# EAGLE board BatteryBoardV1 (EAGLE 7.7.0)
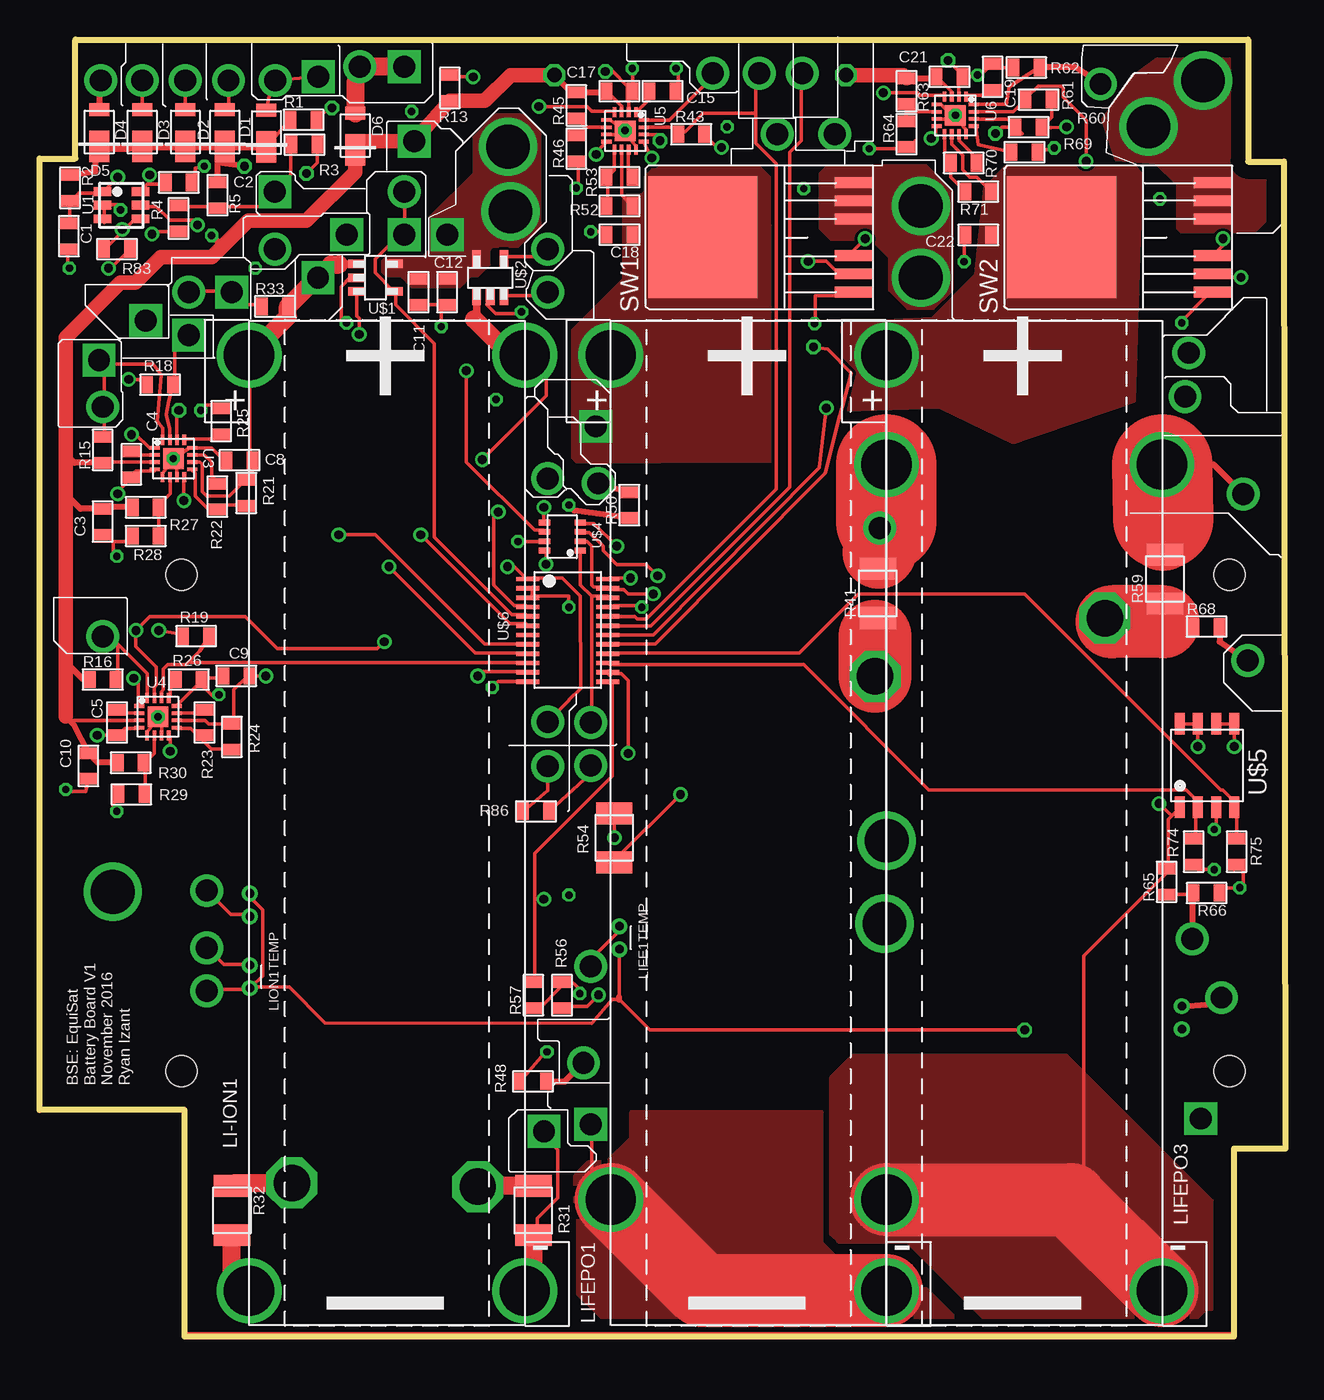
[diagram p6: board, top side]
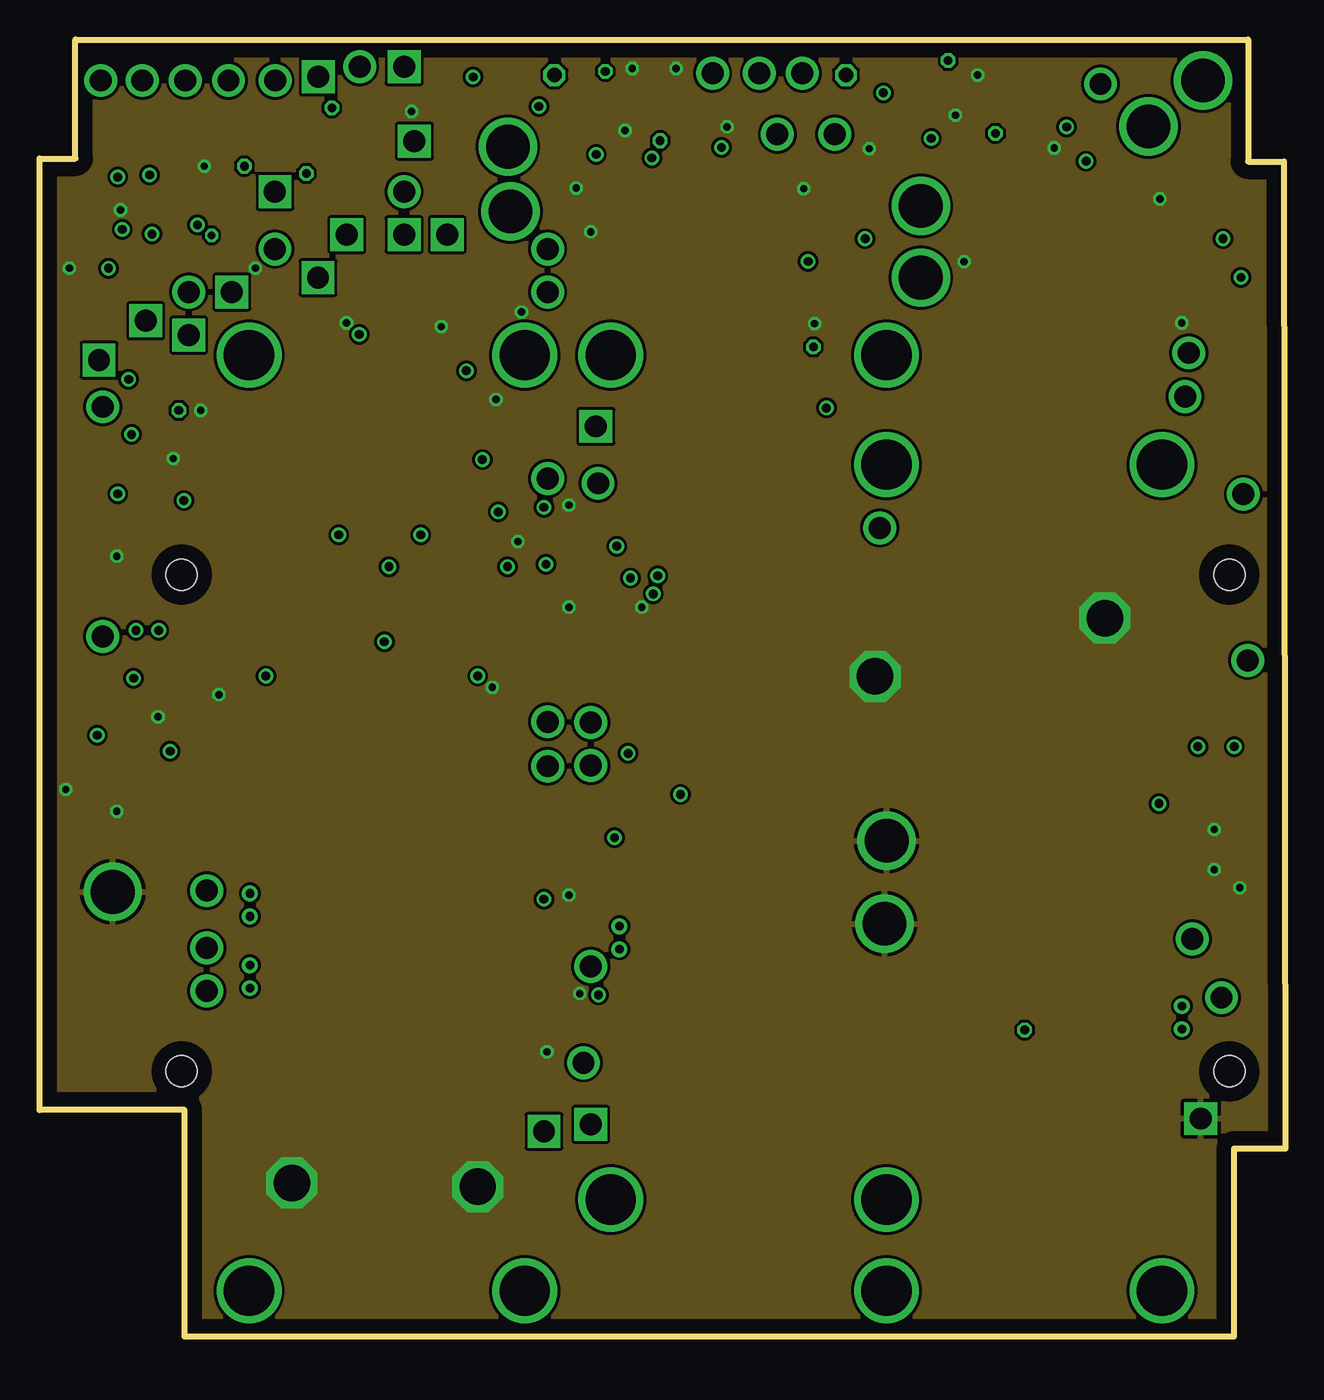
[diagram p7: board, inner layer Route2]
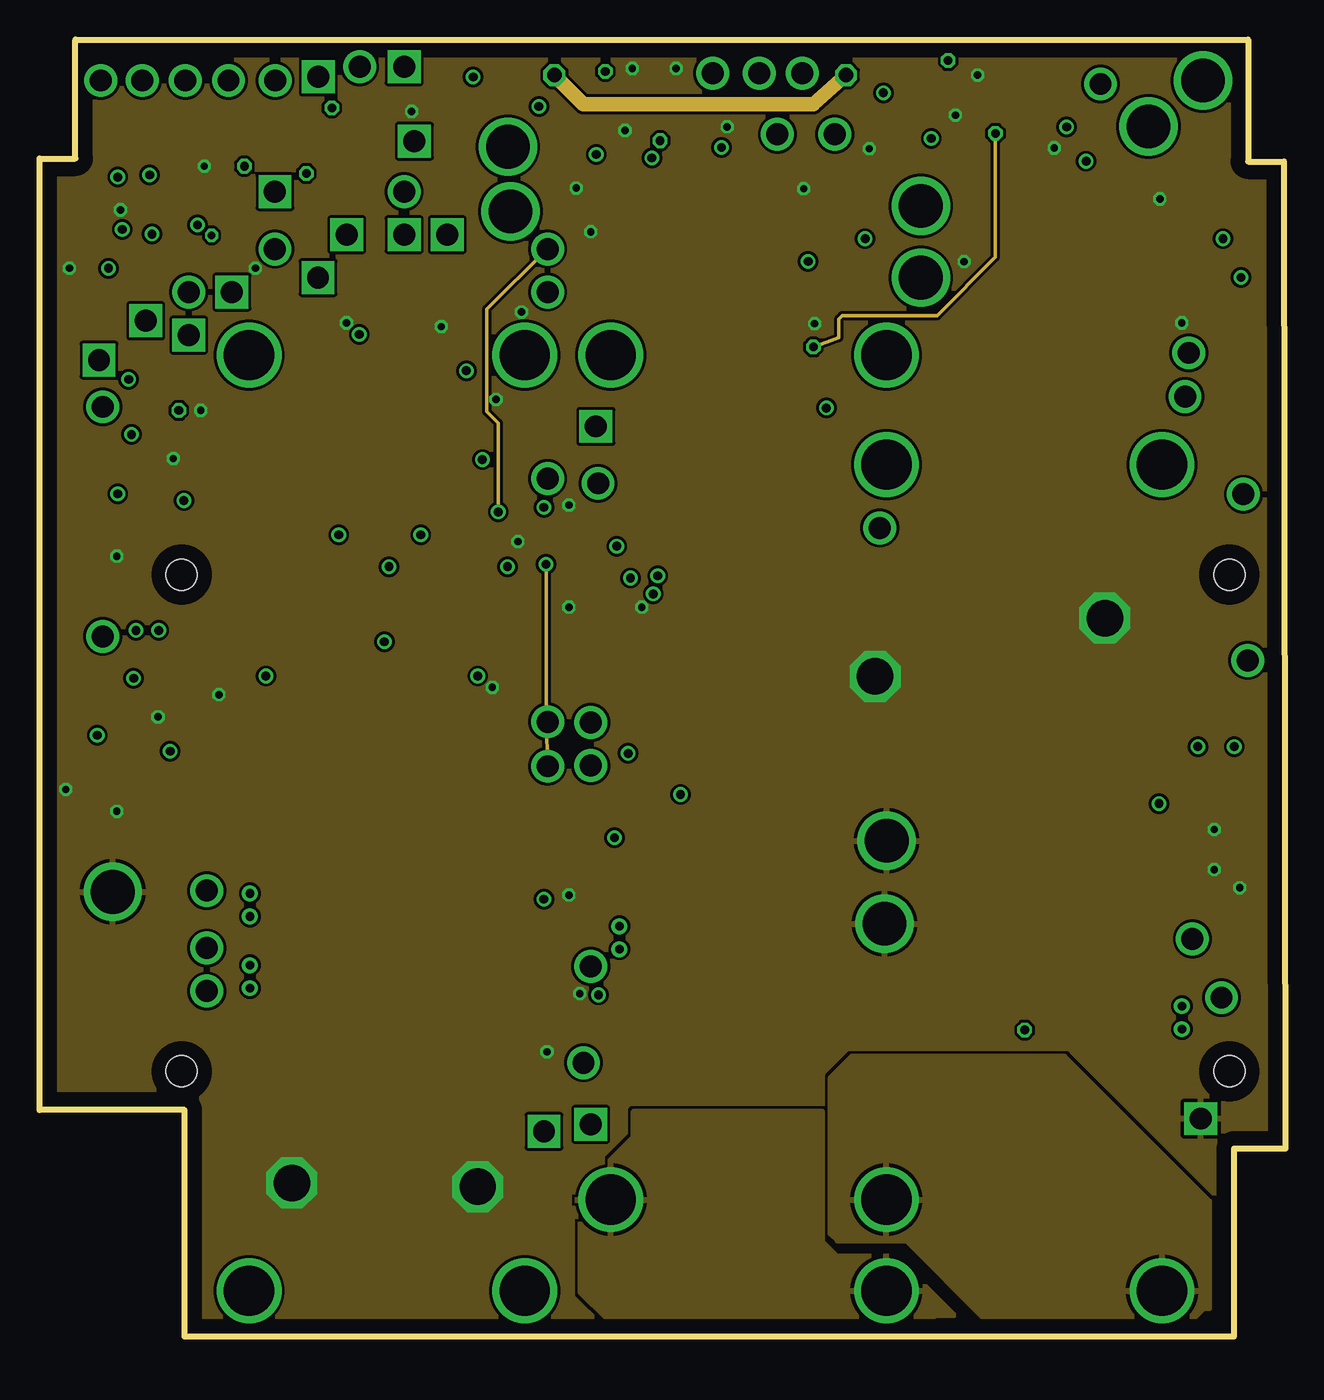
[diagram p8: board, inner layer Route3]
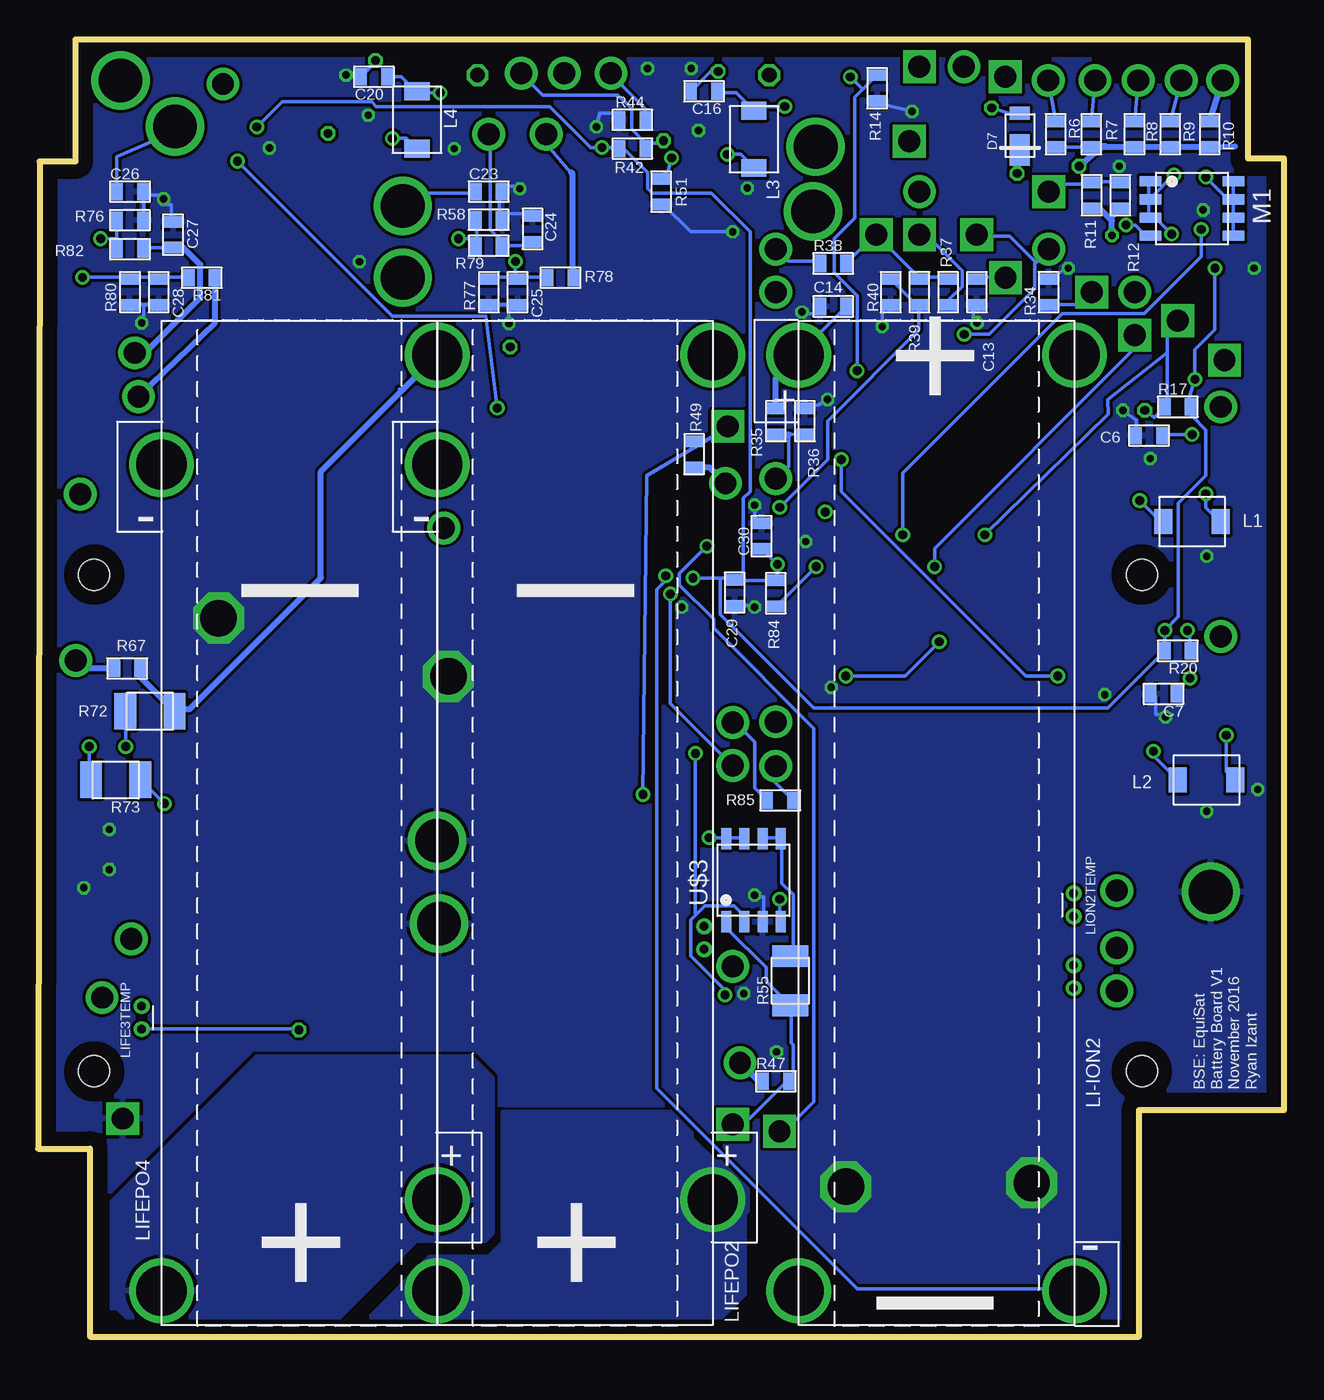
[diagram p9: board, bottom side, seen from below]

Size 86.79 x 90.4 mm. Coordinates in mm from the lower left corner, seen from the top.
Outline: 0,82.1 2.5,82.1 2.5,90.4 84.2,90.4 84.2,81.9 86.69,81.9 86.79,13.1 83.2,13.1 83.2,0 10.1,0 10.1,15.8 0,15.8 0,82.1
Copper layers (1*2*3*16): Top 0.035mm / dielectric 0.25mm / Route2 0.035mm / dielectric 0.25mm / Route3 0.035mm / dielectric 0.25mm / Bottom 0.035mm
Design rules "default *": minimum track width 10mil, minimum drill 24mil, track to track 8mil, track to pad 8mil, pad to pad 8mil, via to via 8mil, smd to smd 8mil, copper to edge 40mil, drill to drill 8mil, minimum pad ring 10mil, minimum via ring 8mil, stop-mask expansion 4mil, vias tented up to drill 0mil, thermal gap 10mil
Holes 2.15 mm at 9.9,18.5 9.9,53.1 82.9,18.5 82.9,53.1

## Footprints (pad centres in the part's own frame; a part is rotated, then mirrored left to right if it is on the bottom)
0805 = smd 0.8 x 1.2: 1 -0.9,0; 2 0.9,0
PWRDI-123 = smd 0.9 x 1.4: A 1.45,0 | smd 2.2 x 1.4: C -1.1,0
1812 = smd 1.25 x 1.75: P$1 -2,0; P$2 2,0
EQUISAT-BATTERY-VA = drill 3.5: MINUS 9.6,-32.6; PLUS -9.6,32.6
FLATPACK = drill 0.6: + -0.8,0; - 0.8,0
EQUISAT-BATTERY-VB = drill 3.5: MINUS 9.6,-24.98; PLUS -9.6,26.25
SO-8 = smd 0.7 x 1.5: P$1 -1.905,-2.9; P$2 -0.635,-2.9; P$3 0.635,-2.9; P$4 1.905,-2.9; P$5 1.905,2.9; P$6 0.635,2.9; P$7 -0.635,2.9; P$8 -1.905,2.9
1210 = smd 1.52 x 2.54: P$1 -1.71,0 | smd 1.51 x 2.54: P$2 1.71,0
TO-263-7-8 = smd 0.75 x 2.6: P$1 0,0.7; P$2 1.27,0.7; P$3 2.54,0.7; P$5 5.08,0.7; P$6 6.35,0.7; P$7 7.62,0.7 | smd 8.5 x 7.6: PAD 3.81,11.2
TSOT23-6 = smd 0.62 x 1.22: P$1 0,0; P$2 0.95,0; P$3 1.9,0; P$4 1.9,2.62; P$5 0.95,2.62; P$6 0,2.62
QFN-16-PAD = smd 0.7 x 0.25: P$1 -1.3,0.75; P$2 -1.3,0.25; P$3 -1.3,-0.25; P$4 -1.3,-0.75; P$9 1.3,-0.25; P$10 1.3,-0.75; P$11 1.3,0.25; P$12 1.3,0.75 | smd 0.25 x 0.7: P$5 -0.75,-1.3; P$6 -0.25,-1.3; P$7 0.25,-1.3; P$8 0.75,-1.3; P$13 0.75,1.3; P$14 0.25,1.3; P$15 -0.25,1.3; P$16 -0.75,1.3 | smd 1.45 x 1.45: P$17 0,0
TSOT23-5 = smd 0.6 x 1.2: P$1 -0.95,-1.306; P$2 0,-1.306; P$3 0.95,-1.306; P$4 0.95,1.306; P$5 -0.95,1.306
SOT-23-8 = smd 0.4 x 0.8: P$1 -1.016,-1.27; P$2 -0.366,-1.27; P$3 0.284,-1.27; P$4 0.934,-1.27; P$5 0.934,1.23; P$6 0.284,1.23; P$7 -0.366,1.23; P$8 -1.016,1.23
TSSOP-24 = smd 0.3 x 1.6: P$1 0,0; P$2 0.65,0; P$3 1.3,0; P$4 1.95,0; P$5 2.6,0; P$6 3.25,0; P$7 3.9,0; P$8 4.55,0; P$9 5.2,0; P$10 5.85,0; P$11 6.5,0; P$12 7.15,0; P$13 7.15,5.6; P$14 6.5,5.6; P$15 5.85,5.6; P$16 5.2,5.6; P$17 4.55,5.6; P$18 3.9,5.6; P$19 3.25,5.6; P$20 2.6,5.6; P$21 1.95,5.6; P$22 1.3,5.6; P$23 0.65,5.6; P$24 0,5.6
VIA-60MIL = drill 1.524: P$1 0,0
VIA-60MIL-SQ = drill 1.524 square: P$1 0,0
VIA-120MIL = drill 3.048: P$1 0,0

## Placement (x,y rotation side)
C1  0.1uF  [0805]  2.04,76.69 270 top
C2  0.1uF  [0805]  9.7,80.44 0 top
C3  10uF  [0805]  4.4,56.8 270 top
C4  22nF  [0805]  6.4,60.8 270 top
C5  22nF  [0805]  5.4,42.8 270 top
C6  2.2uF  [0805]  9.4,62.8 180 bottom
C7  2.2uF  [0805]  8.4,44.8 180 bottom
C8  22uF  [0805]  13.93,61.08 180 top
C9  22uF  [0805]  13.71,46.05 180 top
C10  10uF  [0805]  3.4,39.77 270 top
C11  4.7uF  [0805]  26.4,72.8 270 top
C12  4.7uF  [0805]  28.4,72.8 270 top
C13  1uF  [0805]  21.4,72.8 90 bottom
C14  1uF  [0805]  31.4,71.8 0 bottom
C15  2.2uF  [0805]  43.4,86.8 180 top
C16  22nF  [0805]  40.4,86.8 180 bottom
C17  10uF  [0805]  40.4,86.8 180 top
C18  22uF  [0805]  40.4,76.8 180 top
C19  2.2uF  [0805]  66.4,87.8 270 top
C20  22nF  [0805]  63.4,87.8 180 bottom
C21  10uF  [0805]  63.4,87.8 180 top
C22  22uF  [0805]  65.4,76.78 180 top
C23  10nF  [0805]  55.4,79.8 0 bottom
C24  10nF  [0805]  52.35,77.2 90 bottom
C25  150nF  [0805]  53.4,72.8 90 bottom
C26  10nF  [0805]  80.4,79.8 0 bottom
C27  10nF  [0805]  77.4,76.8 90 bottom
C28  150nF  [0805]  78.4,72.8 90 bottom
C29  0.1uF  [0805]  38.28,51.85 270 bottom
C30  0.1uF  [0805]  36.4,55.8 90 bottom
D1  DFLS130L  [PWRDI-123]  15.81,84.01 90 top
D2  DFLS130L  [PWRDI-123]  12.91,84.05 90 top
D3  DFLS130L  [PWRDI-123]  10.16,84.05 90 top
D4  DFLS130L  [PWRDI-123]  7.16,84.05 90 top
D5  DFLS130L  [PWRDI-123]  4.16,84.05 90 top
D6  DFLS130L  [PWRDI-123]  22,83.81 90 top
D7  DFLS130L  [PWRDI-123]  18.4,83.8 90 bottom
L1  120uH  [1812]  6.4,56.8 180 bottom
L2  120uH  [1812]  5.4,38.8 180 bottom
L3  120uH  [1812]  36.93,83.45 90 bottom
L4  120uH  [1812]  60.4,84.8 90 bottom
LI-ION1  ~4.1V  [EQUISAT-BATTERY-VA]  24.2,35.8 0 top
LI-ION2  ~4.1V  [EQUISAT-BATTERY-VA]  24.2,35.8 0 bottom
LIFE1TEMP  AD590FLATPACK  [FLATPACK]  40.4,27.8 90 top
LIFE3TEMP  AD590FLATPACK  [FLATPACK]  79.59,22.23 90 bottom
LIFEPO1  ~3.5V  [EQUISAT-BATTERY-VA]  49.4,35.8 0 top
LIFEPO2  ~3.5V  [EQUISAT-BATTERY-VB]  49.4,35.8 180 bottom
LIFEPO3  ~3.5V  [EQUISAT-BATTERY-VA]  68.6,35.8 0 top
LIFEPO4  ~3.5V  [EQUISAT-BATTERY-VB]  68.6,35.8 180 bottom
LION1TEMP  AD590FLATPACK  [FLATPACK]  14.65,25.09 90 top
LION2TEMP  AD590FLATPACK  [FLATPACK]  14.65,30.09 270 bottom
M1  BSO201SP  [SO-8]  6.41,78.62 270 bottom
R1  0R  [0805]  18.4,84.8 0 top
R2  0R  [0805]  2.12,80.05 270 top
R3  0R  [0805]  18.46,83.08 180 top
R4  0R  [0805]  9.68,77.93 90 top
R5  0R  [0805]  12.4,79.55 270 top
R6  0R  [0805]  15.91,83.8 270 bottom
R7  0R  [0805]  13.42,83.8 270 bottom
R8  0R  [0805]  10.42,83.8 270 bottom
R9  0R  [0805]  7.92,83.8 270 bottom
R10  0R  [0805]  5.18,83.8 270 bottom
R11  10R  [0805]  13.4,79.55 270 bottom
R12  0R  [0805]  11.4,79.55 270 bottom
R13  40K  [0805]  28.58,87.02 270 top
R14  10K  [0805]  28.34,87.01 90 bottom
R15  10K  [0805]  4.4,61.8 90 top
R16  10K  [0805]  4.4,45.8 0 top
R17  10K  [0805]  7.4,64.8 0 bottom
R18  10K  [0805]  8.4,66.34 180 top
R19  10K  [0805]  10.91,48.82 180 top
R20  10K  [0805]  7.4,47.8 180 bottom
R21  1M  [0805]  14.4,58.8 90 top
R22  1.43M  [0805]  12.39,58.55 270 top
R23  1.43M  [0805]  11.49,42.8 270 top
R24  1M  [0805]  13.4,41.8 90 top
R25  12.1K  [0805]  12.65,63.8 270 top
R26  12.1K  [0805]  10.4,45.8 180 top
R27  330K  [0805]  7.4,57.8 180 top
R28  43K  [0805]  7.4,55.8 0 top
R29  43K  [0805]  6.4,37.8 0 top
R30  330K  [0805]  6.36,40 180 top
R31  0.13R@1W  [1210]  34.4,8.8 270 top
R32  0.13R@1W  [1210]  13.4,8.8 270 top
R33  150K  [0805]  16.4,71.8 0 top
R34  100K  [0805]  16.4,72.8 270 bottom
R35  150K  [0805]  35.4,63.8 90 bottom
R36  100K  [0805]  33.38,63.8 270 bottom
R37  470K  [0805]  23.4,72.8 90 bottom
R38  470K  [0805]  31.4,74.8 0 bottom
R39  150K  [0805]  25.4,72.8 90 bottom
R40  100K  [0805]  27.4,72.8 90 bottom
R41  0.002R@1W  [1210]  58.4,51.8 90 top
R42  10K  [0805]  45.4,82.8 180 bottom
R43  10K  [0805]  45.4,83.8 0 top
R44  100K  [0805]  45.4,84.8 0 bottom
R45  330K  [0805]  37.4,85.8 90 top
R46  43K  [0805]  37.4,82.8 90 top
R47  95K  [0805]  35.4,17.8 0 bottom
R48  100K  [0805]  34.38,17.78 0 top
R49  287K  [0805]  41.09,61.5 270 bottom
R50  100K  [0805]  41.08,57.96 90 top
R51  12.1K  [0805]  43.4,79.8 270 bottom
R52  887K  [0805]  40.4,80.8 180 top
R53  1.74M  [0805]  40.4,78.8 0 top
R54  34.8R@1W  [1210]  40.04,34.76 270 top
R55  34.8R@1W  [1210]  34.4,24.8 90 bottom
R56  10K  [0805]  36.4,23.8 270 top
R57  10K  [0805]  34.4,23.8 90 top
R58  1K  [0805]  55.4,77.83 180 bottom
R59  0.002R@1W  [1210]  78.4,52.8 90 top
R60  10K  [0805]  68.91,84.29 0 top
R61  10K  [0805]  69.61,86.22 0 top
R62  100K  [0805]  68.75,88.45 0 top
R63  330K  [0805]  60.4,86.8 90 top
R64  43K  [0805]  60.4,83.8 90 top
R65  95K  [0805]  78.52,31.7 90 top
R66  100K  [0805]  81.31,30.92 180 top
R67  287K  [0805]  80.59,46.58 180 bottom
R68  100K  [0805]  81.31,49.48 0 top
R69  12.1K  [0805]  68.62,82.55 0 top
R70  887K  [0805]  64.38,81.8 180 top
R71  1.74M  [0805]  65.4,79.8 0 top
R72  34.8R@1W  [1210]  79.02,43.59 0 bottom
R73  34.8R@1W  [1210]  81.4,38.8 180 bottom
R74  10K  [0805]  80.4,33.8 90 top
R75  10K  [0805]  83.4,33.8 90 top
R76  1K  [0805]  80.4,77.8 180 bottom
R77  1K  [0805]  55.4,72.8 90 bottom
R78  4.7K  [0805]  50.4,73.8 180 bottom
R79  4.7K  [0805]  55.4,76.02 180 bottom
R80  1K  [0805]  80.4,72.8 90 bottom
R81  4.7K  [0805]  75.4,73.8 180 bottom
R82  4.7K  [0805]  80.4,75.8 180 bottom
R83  470K  [0805]  5.4,75.8 0 top
R84  1K  [0805]  35.4,51.8 90 bottom
R85  2.4K  [0805]  35.1,37.38 0 bottom
R86  2.4K  [0805]  34.59,36.61 180 top
SW1  BTS50015-1TAD  [TO-263-7-8]  57.4,72.8 90 top
SW2  BTS50015-1TAD  [TO-263-7-8]  82.4,72.8 90 top
U1  LTC4412MPS6  [TSOT23-6]  4.4,79.8 270 top
U3  LTC4121  [QFN-16-PAD]  9.33,61.2 0 top
U4  LTC4121  [QFN-16-PAD]  8.25,43.2 0 top
U5  LTC4121  [QFN-16-PAD]  40.8,84.03 270 top
U6  LTC4121  [QFN-16-PAD]  63.8,85.11 270 top
U$1  LTC4411  [TSOT23-5]  23.4,73.8 270 top
U$2  LTC4411  [TSOT23-5]  31.4,73.8 0 top
U$3  VNS3NV04DP-E  [SO-8]  36.96,31.81 0 bottom
U$4  AD7991-0  [SOT-23-8]  36.4,55.8 90 top
U$5  VNS3NV04DP-E  [SO-8]  81.34,39.81 0 top
U$6  TCA9535PWR  [TSSOP-24]  34,52.8 270 top
V1  UMB_CHG  [VIA-60MIL]  22.3,88.5 0 top
V2  X_P  [VIA-60MIL]  16.42,87.55 90 top
V3  X_N  [VIA-60MIL]  13.16,87.55 90 top
V4  Z_P  [VIA-60MIL]  10.16,87.55 90 top
V5  Z_N  [VIA-60MIL]  7.16,87.55 90 top
V6  Y_N  [VIA-60MIL]  4.26,87.55 90 top
V7  SP_C_O  [VIA-60MIL-SQ]  16.4,79.8 0 top
V8  SP_OUT  [VIA-60MIL-SQ]  26.11,83.31 0 top
V9  5V  [VIA-60MIL]  11.65,24.09 0 top
V10  L1_CHG  [VIA-60MIL]  4.4,64.8 90 top
V11  !BATT_INT!  [VIA-60MIL]  35.4,42.85 0 top
V12  GND  [VIA-60MIL-SQ]  80.9,15.2 0 top
V13  GND  [VIA-120MIL]  5.1,31 90 top
V14  LIFEB1SNS  [VIA-60MIL]  58.54,56.36 0 top
V15  LF_B1_CHG  [VIA-60MIL]  46.89,88.05 0 top
V16  LIFE2  [VIA-60MIL-SQ]  38.4,14.8 0 top
V17  LIFE1  [VIA-60MIL-SQ]  38.76,63.44 0 top
V18  LF_B1_CHGN  [VIA-60MIL]  53.15,88.05 270 top
V19  LF_B1_FAULTN  [VIA-60MIL]  50.15,88.05 90 top
V20  LF_B1_OUTEN  [VIA-60MIL]  51.4,83.8 180 top
V21  LF_B1  [VIA-120MIL]  61.4,78.8 0 top
V22  GND  [VIA-120MIL]  58.87,28.78 270 top
V23  GND  [VIA-120MIL]  59.02,34.56 0 top
V24  L1_TEMP  [VIA-60MIL]  11.65,27.09 0 top
V25  L1_REF  [VIA-60MIL]  10.4,72.8 90 top
V26  LF_B1  [VIA-120MIL]  61.4,73.8 0 top
V27  LIFE_B2  [VIA-120MIL]  77.26,84.34 0 top
V28  LIFE_B2  [VIA-120MIL]  81.05,87.54 0 top
V29  L2_REF  [VIA-60MIL]  35.4,59.8 90 top
V30  L_OUT  [VIA-120MIL]  32.63,82.93 0 top
V31  LF_B1_OSNS  [VIA-60MIL]  55.4,83.8 180 top
V32  L2_TEMP  [VIA-60MIL]  11.65,31.09 0 top
V33  L2_CHG  [VIA-60MIL]  4.4,48.8 0 top
V34  L1_DISG  [VIA-60MIL]  16.4,75.8 0 top
V35  L2_DISG  [VIA-60MIL]  35.4,72.8 180 top
V36  L1_ST  [VIA-60MIL]  25.4,79.8 0 top
V37  LF1_TEMP  [VIA-60MIL]  38.4,25.8 0 top
V38  L2_ST  [VIA-60MIL]  35.4,75.8 0 top
V39  UMB_CHG  [VIA-60MIL-SQ]  25.4,88.5 0 top
V40  L1_CHG  [VIA-60MIL-SQ]  4.15,68.05 0 top
V41  L1_FAULTN  [VIA-60MIL-SQ]  10.4,69.8 0 top
V42  L1_CHGN  [VIA-60MIL-SQ]  7.4,70.8 0 top
V43  L1_SNS  [VIA-60MIL-SQ]  35.15,14.31 0 top
V44  L1_REF  [VIA-60MIL-SQ]  13.4,72.8 90 top
V45  LION1  [VIA-60MIL-SQ]  19.4,73.8 0 top
V46  L1_DISG  [VIA-60MIL-SQ]  21.4,76.8 0 top
V47  L1_ST  [VIA-60MIL-SQ]  25.4,76.8 0 top
V48  L_OUT  [VIA-60MIL-SQ]  28.4,76.8 0 top
V49  X_P  [VIA-60MIL-SQ]  19.42,87.8 0 top
V50  LF3_TEMP  [VIA-60MIL]  82.34,23.63 0 top
V51  3V3  [VIA-60MIL]  35.4,39.75 0 top
V52  SCL  [VIA-60MIL]  38.4,42.8 0 top
V53  SDA  [VIA-60MIL]  38.4,39.8 0 top
V54  L_OUT  [VIA-120MIL]  32.82,78.42 0 top
V56  LF_B2_OUTEN  [VIA-60MIL]  79.81,65.52 0 top
V57  LF_B2_CHG  [VIA-60MIL]  73.92,87.31 0 top
V58  LF1_REF  [VIA-60MIL]  38.91,59.47 0 top
V59  LF2_REF  [VIA-60MIL]  37.9,19.09 0 top
V60  LF_B2_SNS  [VIA-60MIL]  83.87,58.71 90 top
V61  LF4_REF  [VIA-60MIL]  80.31,27.72 0 top
V62  LF3_REF  [VIA-60MIL]  84.17,47.13 270 top
V63  LF_B2_OSNS  [VIA-60MIL]  80.06,68.56 0 top

## Tracks (layer width: path | path; a pad name or v marks a point on that pad's centre or on a via)
3V3  (via drill 0.61)
  Top 0.254: v47.52,82.87 47.2,82.87 46.41,83.67 R43.2 | v71.56,84.3 71.18,84.3 70.44,84.27 R60.2 70.51,84.99 R61.2 | v35.29,53.82 35.29,54.77 U$4.P$8 | v41.17,52.87 39.74,52.87 U$6.P$24 | v8.3,49.22 9.83,48.96 R19.2 | v6.21,66.71 6.9,66.71 7.35,66.36 R18.2 | v4.81,74.46 4.97,74.46 6.24,75.73 R83.2 | R86.2 35.4,38.07 V51.P$1
  Route3 0.254: v35.29,53.82 35.29,42.87 V51.P$1
  Bottom 0.254: v71.56,84.3 69.81,86.05 63.55,86.05 63.23,85.73 51.17,85.73 48.31,82.87 v47.52,82.87 46.41,82.87 R42.2 46.25,82.72 45.93,82.72 44.34,81.13 44.34,80.02 44.02,79.7 39.9,79.7 37.2,77 37.2,58.9 37.67,58.43 37.67,52.71 | 37.67,52.71 35.45,52.71 R84.2 35.29,52.71 v35.29,53.82 36.24,54.77 C30.1 | 37.67,52.71 38.15,52.71 C29.1 38.31,52.87 39.26,52.87 | 39.26,52.87 v41.17,52.87 | v4.81,74.46 4.81,70.17 6.21,68.78 v6.21,66.71 6.72,65.09 6.56,64.94 R17.2 6.4,64.78 6.4,64.14 5.45,63.19 5.45,60.01 7.35,58.11 7.35,50.17 v8.3,49.22 8.3,47.95 R20.2 12.27,43.82 32.75,43.82 39.26,50.33 39.26,52.87 | R85.2 35.4,38.57 V51.P$1
5V  (via drill 0.61)
  Top 0.254: 40.37,23.66 40.37,26.99 LIFE1TEMP.+ | LION1TEMP.+ 14.59,24.2 11.73,24.2 V9.P$1 | LION2TEMP.+ 14.75,30.87 14.75,30.55 15.54,29.76 15.54,25.15 14.75,24.36 LION1TEMP.+ | LION1TEMP.+ 14.91,24.36 17.39,24.36 19.86,21.88 38.47,21.82 39.9,23.5 40.37,23.5 42.5,21.37 v68.63,21.37
  Top 0.406: 40.37,23.5 40.37,23.66
  Bottom 0.254: v68.63,21.37 68.69,21.43 LIFE3TEMP.+
!BATT_INT!  (via drill 0.61)
  Top 0.254: v32.59,53.66 33.07,53.66 33.86,52.87 U$6.P$1 34.02,52.87 36.4,52.87 37.67,51.6 37.7,45.19 36.91,44.39 36.88,44.33 35.45,42.9 V11.P$1
  Bottom 0.254: v32.59,53.66 35.29,50.96 R84.1
GND  (via drill 0.51, 2.54)
  Top 0.254: R59.P$1 78.4,49.94 78.28,49.82 | 81.97,31.28 R66.1 82.6,31.28 v83.62,31.28 83.87,31.28 83.87,32.55 R75.1 83.23,32.55 | 81.97,36.99 U$5.P$3 81.97,36.36 81.97,35.72 v81.84,35.34 | 80.06,33.18 R74.1 80.7,32.55 v81.84,32.55 81.97,32.55 | 62.28,85.89 U6.P$5 62.76,85.86 62.81,85.86 63.22,85.46 63.45,85.46 U6.P$17 | 61.01,83.35 61.01,82.72 60.38,82.72 R64.1 60.29,82.79 v57.81,82.79 | 11.48,45.88 9.57,43.98 U4.P$12 | 11.48,45.88 12.75,45.88 C9.2 | 11.48,45.88 R26.1 11.48,45.25 12.12,44.61 v12.5,44.74 | R57.1 34.98,23.03 36.24,24.3 36.24,24.93 R56.1 36.88,24.93 37.52,24.3 v37.64,23.91 | 27.99,71.92 26.72,71.92 C11.2 | 34.34,51.6 34.34,52.23 U$6.P$2 | 9.57,61.12 9.57,59.85 U3.P$7 | 4.5,78.91 4.5,77.63 U1.P$3 | v33.32,55.41 34.98,55.41 U$4.P$7 | C10.2 3.23,38.01 1.96,38.01 v1.83,38.14 | R29.1 5.13,37.63 5.13,36.99 v5.38,36.61 | R48.1 35.36,19.98 35.48,19.85 v35.36,19.85 | 5.13,55.41 4.5,56.04 C3.2 | 5.13,55.41 5.13,54.77 v5.38,54.39 | 5.13,55.41 6.4,55.41 R28.1 | C8.2 12.75,61.12 12.75,61.18 11.99,61.94 10.64,61.94 U3.P$12 10.41,61.94 v9.32,61.2 | R25.1 12.12,64.94 11.61,64.94 v11.23,64.55 | C1.2 1.96,75.73 1.96,74.46 v2.08,74.46 | C2.2 10.85,80.81 10.85,81.44 v11.48,81.57 | U$1.P$2 21.64,73.83 21.01,73.19 21.01,70.65 v21.39,70.65 | U$2.P$2 31.16,71.92 31.8,71.28 33.7,71.28 v33.58,71.41 | R46.1 37.52,82.08 37.52,80.17 v37.39,80.05 | v38.4,77 39.42,77 C18.2 | C17.1 41.32,87.16 41.32,88.43 v41.3,88.38 | C15.1 44.5,87.16 44.5,88.43 v44.35,88.38 | R69.2 69.9,82.72 70.54,82.72 v70.69,82.84 | 65.45,87.8 64.19,87.8 C21.1 | 65.45,87.8 66.09,88.43 C19.1 66.73,88.43 68,88.43 R62.1 | 65.45,87.8 v65.35,87.92
  Top 0.254: U4.P$17 8.3,43.34 v8.25,43.19 | v40.79,84.06 40.69,83.98 U5.P$17 41.15,83.5 41.55,82.97 U5.P$12 | U6.P$17 64.19,85.25 v63.8,85.13 | 4.5,78.91 5.77,78.91 v5.64,78.52 | 4.5,78.91 U1.P$2 | U$6.P$21 40.05,50.96 41.96,50.96 v41.96,50.84 | 9.57,61.12 U3.P$17 | 9.57,61.12 v9.32,61.2 | 34.34,51.6 36.88,51.6 v36.88,50.84 | 34.34,51.6 U$6.P$3 | v27.99,70.4 27.99,71.92 | 27.99,71.92 C12.2 | SW1.P$1 56.56,72.55 54.02,72.55 54.02,70.65 v54,70.6 | SW2.P$1 81.33,72.55 79.43,70.65 v79.58,70.65 | 53.39,80.17 v53.24,80 | 74.73,49.82 74.34,50.33 v74.22,50.08 | U5.P$5 39.75,84.77 v40.79,84.06 | U5.P$7 40.79,83.78 v40.79,84.06 | U6.P$7 63.55,84.86 U6.P$17 | U6.P$12 64.55,84.03 64.54,84.04 64.54,84.16 64.08,84.62 64.08,84.83 U6.P$17 | U3.P$5 8.58,60.18 8.61,60.21 v9.32,61.2 | U4.P$7 8.5,42.95 v8.25,43.19 | U4.P$5 7.5,42.13 7.52,42.15 v8.25,43.19 | U$6.P$12 31.95,45.65 v31.55,45.25 | 64.57,77 C22.2 64.41,76.7 v64.41,74.92
  Top 0.406: R68.1 78.86,49.48 78.4,49.94 | R50.1 37.27,57.56 v36.88,57.95
  Top 0.508: 58.22,48.81 58.22,49.91 R41.P$1
  Top 1.27: R31.P$1 30.59,10.51 v30.53,10.45 | R32.P$1 13.6,10.71 v17.58,10.71
  Top 5.08: 78.28,49.82 74.73,49.82 | v58.22,46.01 58.22,48.81
  Bottom 0.254: 54.66,78.27 54.66,79.54 C23.2 54.66,80.17 53.39,80.17 v53.24,80 | 54.66,78.27 52.75,78.27 C24.2 | 54.66,78.27 R58.1 | 76.89,77.63 C27.2 77.52,77.63 77.52,78.91 78.16,78.91 v78.05,79.29 78.16,79.54 79.43,79.54 | 79.43,79.54 79.43,78.27 R76.1 | 79.43,71.92 80.06,71.92 R80.1 | 79.43,71.92 78.79,71.92 C28.1 | 54.02,71.92 55.3,71.92 R77.1 | 54.02,71.92 53.39,71.92 C25.1 | 43.87,78.91 R51.2 43.23,78.91 41.32,77 v38.4,77 | C7.2 8.94,44.61 8.94,43.34 8.3,43.34 v8.25,43.19 | C29.2 38.15,50.96 36.88,50.96 v36.88,50.84 | R34.1 15.93,73.83 15.29,74.46 v15.04,74.46 | C13.1 21.64,71.92 21.64,70.65 v21.39,70.65 | v36.88,57.95 36.88,56.68 C30.2 | v27.99,70.4 27.99,71.92 R40.1 | R36.1 33.58,64.94 32.44,64.94 v31.8,65.32 | C14.1 32.44,71.28 33.7,71.28 v33.58,71.41 | v25.92,85.39 27.99,85.89 R14.1 | R44.1 46.41,85.25 47.67,85.25 v47.9,84.31 | U$3.P$3 36.24,29.38 36.24,30.64 v36.88,30.77 | 54.02,71.92 54.02,70.65 v54,70.6 | 79.43,71.92 79.43,70.65 v79.58,70.65 | 79.43,79.54 C26.2 | C6.2 10.3,63.88 v11.23,64.55
  pour Route2: -6.6,94.8 107.4,94.8 107.4,-17.2 -6.6,-17.2
  pour Bottom (rank 4): -2.7,100.7 -2.5,99.8 106.1,99.8 110.8,95.1 110.8,-16.6 -4.6,-16.6 -4.6,99 -4.2,99.8 -5.2,99.8 -5.5,100.4 -4.6,101.2 -3.3,101.3
  pour Route3 (rank 4): -11.3,96.7 102.7,96.7 102.7,-15.3 -11.3,-15.3
L1_CHG
  Top 0.254: R15.2 4.5,62.71 4.5,64.78 V10.P$1 4.5,64.94 4.5,67.79 | 4.5,67.79 7.92,67.79 8.46,67 8.21,63.82 8.58,63.32 8.58,62.9 U3.P$16 | 4.5,67.79 V40.P$1
L1_CHGN  (via drill 0.61)
  Top 0.254: v20.85,55.89 23.39,55.89 31.01,48.27 33.86,48.27 U$6.P$8 | U3.P$14 9.57,64.43 v9.7,64.55
  Bottom 0.254: 8.15,68.59 8.15,70.02 7.51,70.65 V42.P$1 | 8.15,68.59 8.15,64.94 R17.1 9.05,64.05 v9.7,64.55 | 8.15,68.59 12.27,65.32 12.24,64.3 v20.85,55.89
L1_DISG  (via drill 0.61)
  Top 0.254: v22.27,69.86 22.27,70.97 22.12,71.13 22.12,72.71 U$1.P$3
  Bottom 0.254: v22.27,69.86 20.53,69.86 17.35,73.03 17.35,74.78 17.27,74.86 | 17.27,74.86 16.4,75.73 V34.P$1 | 17.27,74.86 19.1,76.68 21.32,76.68 V46.P$1
L1_FAULTN  (via drill 0.61)
  Top 0.254: U3.P$15 9.07,63.24 8.85,64.27 9,65.19 R18.1 9.42,66.36 9.42,68.74 10.37,69.7 V41.P$1 | v24.34,53.66 30.37,47.63 33.86,47.63 U$6.P$9
  Bottom 0.254: v24.34,53.66 24.34,54.93 10.53,68.74 10.53,69.7 V41.P$1
L1_REF
  Top 0.254: R33.1 15.45,71.92 14.34,71.92 13.54,72.71 V44.P$1 13.39,72.87 10.53,72.87 V25.P$1
  Bottom 0.254: R34.2 16.24,71.92 14.34,71.92 13.54,72.71 V44.P$1
L1_SNS  (via drill 0.61)
  Top 0.254: v40.21,55.09 38.63,56.68 37.67,56.68 U$4.P$4 | R31.P$2 34.66,7.63 34.66,8.26 36.09,9.69 36.09,13.02 35.45,13.66 V43.P$1
  Top 1.27: R31.P$2 34.4,3.8 LI-ION1.MINUS
  Bottom 0.254: v40.21,55.09 42.12,53.19 42.12,52.39 39.74,50.01 39.74,49.38 32.75,42.39 32.75,16.36 35.29,13.82 V43.P$1
L1_ST
  Top 0.254: U$6.P$5 33.86,50.33 32.91,50.33 27.51,55.73 27.51,69.22 24.81,71.92 24.81,72.71 U$1.P$4 24.66,72.87 23.39,74.14 23.39,75.09 24.97,76.68 25.29,76.68 V47.P$1 25.45,76.84 25.45,79.7 V36.P$1
  Bottom 0.254: R37.1 23.39,71.92 23.39,72.24 22.43,73.19 22.43,74.3 24.81,76.68 25.29,76.68 V47.P$1
L1_TEMP
  Top 0.254: LION1TEMP.- 14.59,25.95 12.85,25.95 11.73,27.06 V24.P$1
L2_CHG
  Top 0.254: 5.53,48.19 4.97,48.74 4.5,48.74 V33.P$1 | 5.53,48.19 7.51,46.2 7.51,44.61 U4.P$16 | R16.2 5.45,45.88 5.45,48.11 5.53,48.19
L2_CHGN
  Top 0.254: 10.45,47.08 11.16,47.79 R19.1 | 10.45,47.08 10.21,46.84 8.94,46.84 8.62,46.52 8.62,45.09 8.46,44.93 8.46,44.61 U4.P$14 | U$6.P$10 33.86,47 10.53,47 10.45,47.08
L2_DISG
  Top 0.254: U$2.P$3 32.44,72.55 35.13,72.55 35.29,72.71 V35.P$1
L2_FAULTN  (via drill 0.61)
  Top 0.254: U4.P$15 7.99,44.61 7.99,45.25 8.15,45.41 8.15,46.68 6.72,48.11 v6.72,49.22 7.67,50.17 14.34,50.17 16.56,47.95 23.55,47.95 v24.02,48.42 | v30.53,46.04 30.85,46.36 33.86,46.36 U$6.P$11
  Bottom 0.254: v6.72,49.22 6.56,49.06 6.56,47.95 R20.1 | v30.53,46.04 26.4,46.04 v24.02,48.42
L2_REF
  Bottom 0.254: R36.2 34.5,62.87 34.5,60.65 35.29,59.85 V29.P$1 | 35.45,62.87 R35.1
  Bottom 0.406: R35.1 35.37,62.87 34.5,62.87
L2_SNS  (via drill 0.61)
  Top 0.254: v43.07,53.03 42.28,53.82 40.21,53.82 39.26,54.77 39.26,55.09 38.31,56.04 37.67,56.04 U$4.P$3
  Top 1.27: LI-ION2.MINUS 13.4,4.4 R32.P$2
  Bottom 0.254: v43.07,53.03 43.07,52.71 43.71,52.08 43.71,17.31 29.74,3.34 14.66,3.34 LI-ION2.MINUS
L2_ST  (via drill 0.61)
  Top 0.254: U$2.P$4 32.44,75.25 34.82,75.25 35.29,75.73 V38.P$1 | v31.96,57.47 31.64,57.16 31.64,52.39 33.07,50.96 33.86,50.96 U$6.P$4
  Route3 0.254: v31.96,57.47 31.96,63.66 31.16,64.46 31.16,71.6 35.29,75.73 V38.P$1
  Bottom 0.254: R38.1 32.44,74.94 34.5,74.94 35.29,75.73 V38.P$1
L2_TEMP
  Top 0.254: LION2TEMP.- 14.59,29.44 13.32,29.44 11.73,31.03 V32.P$1
L_OUT
  Bottom 0.254: R37.2 23.55,73.83 25.29,73.83 R39.2 25.45,73.83 28.31,76.68 V48.P$1 28.47,76.84 30.37,74.94 R38.2
  pour Top (no thermals): 26.21,75.22 24.18,75.22 23.93,74.97 23.93,73.95 25.2,73.95 25.96,73.19 29.26,73.19 30.02,73.95 30.53,73.95 31.29,74.71 31.29,75.73 31.55,75.98 33.32,75.98 34.85,77.51 34.85,84.11 33.83,85.13 31.8,85.13 30.28,83.6 30.28,81.06 27.23,78.02 27.23,75.73 26.72,75.22 26.47,75.22
L_REF  (via drill 0.61)
  Top 0.254: v35.13,57.79 35.13,56.84 U$4.P$5
  Bottom 0.254: v35.13,57.79 31.8,61.12 31.8,63.82 25.45,70.17 25.45,71.76 | 25.45,71.76 27.35,73.67 R40.2 | 25.45,71.76 R39.1
LF1_REF
  Top 0.406: R50.2 39.02,59.36 V58.P$1
  Bottom 0.406: R49.2 40.04,60.6 V58.P$1
LF1_TEMP
  Top 0.254: LIFE1TEMP.- 40.37,28.58 40.37,28.26 38.47,26.36 38.47,25.88 V37.P$1
LF2_REF
  Top 0.406: R48.2 36.59,17.78 V59.P$1
  Bottom 0.406: R47.1 36.61,17.8 V59.P$1
LF3_REF
  Top 0.406: R68.2 82.21,48.44 V62.P$1
  Bottom 0.406: R67.2 83.67,46.58 V62.P$1
LF3_TEMP
  Top 0.406: LIFE3TEMP.- 81.37,23.16 V50.P$1
LF4_REF
  Top 0.254: R65.1 78.63,30.8 80.38,30.8 R66.2
  Top 0.406: 80.38,30.8 80.31,30.74 V61.P$1
LF_B1
  Bottom 0.254: C23.1 56.41,79.7 60.53,79.7 61.33,78.91 V21.P$1
  pour Top (no thermals): 54.91,81.57 61.77,81.57 63.55,79.79 63.55,72.94 62.28,71.67 60.5,71.67 59.23,72.94 59.23,75.22 57.96,76.49 55.17,76.49 54.41,77.25 54.41,81.06
LF_B1_BT  (via drill 0.61)
  Top 0.254: 34.5,30.49 34.5,33.66 39.9,39.06 39.9,45.41 39.74,45.57 U$6.P$13 | 34.5,30.49 34.5,24.77 R57.2 | 34.5,30.49 v35.13,30.49
  Bottom 0.254: v35.13,30.49 35.13,29.06 U$3.P$4
LF_B1_CHG
  Top 0.254: U5.P$16 42.12,84.78 43.87,84.78 47.04,87.95 V15.P$1
  Bottom 0.254: R44.2 44.5,85.57 46.88,87.95 V15.P$1
LF_B1_CHGN  (via drill 0.61)
  Top 0.254: U$6.P$19 39.74,49.54 42.59,49.54 52.28,59.22 52.28,82.56 53.07,83.35 53.07,87.95 V18.P$1 | v43.23,83.35 43.05,83.78 U5.P$14
  Bottom 0.254: 44.5,83.19 R42.1 | 44.5,83.19 45.45,84.14 45.45,85.57 46.41,86.52 51.64,86.52 53.07,87.95 V18.P$1 | 44.5,83.19 43.64,83.19 v43.23,83.35
LF_B1_FAULTN
  Top 0.254: U5.P$15 42.12,84.3 44.02,84.3 44.5,83.83 R43.1 44.5,83.98 44.98,83.98 46.25,85.25 49.9,85.25 | 49.9,85.25 49.9,87.8 50.06,87.95 V19.P$1 | 49.9,85.25 49.9,83.19 51.33,81.76 51.33,59.06 42.28,50.01 41.64,50.01 41.48,50.17 39.74,50.17 U$6.P$20
LF_B1_OSNS
  Bottom 0.254: C24.1 52.44,76.21 52.6,76.05 54.34,76.05 R79.1 54.5,76.05 54.5,76.36 55.3,77.16 55.3,83.67 V31.P$1
LF_B1_OUTEN
  Bottom 0.254: 49.67,81.13 51.33,83.03 51.33,83.67 V20.P$1 | 49.42,73.83 R78.1
  Bottom 0.406: 49.67,81.13 49.64,81.13 49.58,81.06 49.58,73.88 R78.1
LF_B1_TT  (via drill 0.61)
  Top 0.254: v38.94,23.82 38.15,23.03 36.4,23.03 R56.2 | 39.74,46.2 40.53,46.2 41.01,45.73 v41.01,40.65
  Top 0.406: 39.74,46.2 39.64,46.3 U$6.P$14
  Bottom 0.254: v38.94,23.82 38.94,24.14 41.32,26.52 41.32,29.06 40.93,29.45 | 40.93,29.45 40.37,30.01 38.31,30.01 37.67,29.38 37.67,29.06 U$3.P$2 | v41.01,40.65 41.01,29.53 40.93,29.45
LF_B2_BT
  Top 0.254: R75.2 83.39,34.77 83.39,36.84 U$5.P$4 83.23,36.99 83.23,37.31 82.44,38.11 82.28,38.11 68.63,51.76 57.04,51.76 52.91,47.63 39.74,47.63 U$6.P$16
LF_B2_CHG
  Top 0.254: U6.P$16 65.14,85.89 67.36,85.89 67.55,87.1 R62.2
  Top 0.406: V57.P$1 72.16,88.45 R62.2
LF_B2_CHGN  (via drill 0.61)
  Top 0.254: R60.1 67.44,84.86 U6.P$14 | 68.47,83.83 68.15,84.14 R60.1 | U$6.P$17 39.74,48.27 42.91,48.27 54.75,60.2 55.75,64.18 55.96,64.9 56.56,67.16 54.91,68.81 v53.91,68.97 | v66.6,83.86 67.03,84.29 R60.1
  Route3 0.254: v53.91,68.97 55.68,69.63 55.68,70.9 55.93,71.16 62.53,71.16 66.6,75.22 v66.6,83.86
LF_B2_FAULTN  (via drill 0.61)
  Top 0.254: U6.P$15 67.84,85.36 R61.1 68.79,86.37 69.58,87.16 71.17,87.16 71.33,87 71.33,86.37 72.92,84.78 v72.92,81.92 | v54.81,64.72 54.31,60.56 42.75,48.9 39.74,48.9 U$6.P$18
  Bottom 0.254: v54.81,64.72 55.61,71.13 62.12,71.13 v72.92,81.92
LF_B2_OSNS
  Bottom 0.254: C27.1 77.52,75.89 79.43,75.89 R82.1
  Bottom 0.406: V63.P$1 79.55,68.36 75.49,72.43 75.49,74.71 76.67,75.9 C27.1
LF_B2_OUTEN
  Bottom 0.406: R81.1 74.5,70.62 V56.P$1
LF_B2_SNS
  Top 0.254: 78.28,55.92 78.28,54.63 R59.P$2
  Top 0.406: V60.P$1 81.8,60.78 LIFEPO4.MINUS
  Top 5.08: 78.3,57 78.28,55.92
  Top 7: LIFEPO4.MINUS 78.3,57
LF_B2_TT
  Top 0.254: R74.2 80.54,34.77 80.54,36.68 80.7,36.84 U$5.P$2 80.7,36.99 80.7,37.31 79.9,38.11 61.96,38.11 53.23,46.84 39.74,46.84 U$6.P$15
LIFE1  (via drill 0.61)
  Top 0.254: v44.66,37.79 40.05,33.18 R54.P$2 | U5.P$9 40.55,79.55 R53.2
  Bottom 0.254: v44.66,37.79 44.41,60.01 40.74,62.18 38.78,63.35 V17.P$1
  Bottom 0.406: R49.1 40.96,62.4 40.74,62.18
  pour Top (no thermals): 42.72,81.57 42.72,81.32 42.21,80.81 42.21,79.79 41.96,79.54 40.94,79.54 40.69,79.29 40.69,73.7 37.13,70.14 37.13,61.25 37.39,61 43.23,61 50.95,61.02 50.85,80.81 50.09,81.57
LIFE2
  Top 0.254: V16.P$1 38.47,14.77 38.47,11.6 LIFEPO2.PLUS
  Top 5.08: LIFEPO1.MINUS 46.15,3.2 LIFEPO2.PLUS
  Bottom 0.254: U$3.P$1 38.78,28.9 38.78,28.42 36.09,25.72 36.09,24.77 34.5,23.18 R55.P$1 34.34,23.03 34.34,20.48 34.18,20.33 34.18,18.26 34.5,17.95 R47.2 34.66,17.79 37.52,14.93 38.31,14.93 V16.P$1
  pour Top: 37.6,8.6 37.4,8.8 37.4,11.2 38.3,12.1 39.6,12.1 41.3,13.8 41.3,15.6 54.4,15.6 54.4,6.5 55.4,5.5 55.6,5.5 59.4,5.5 59.5,5.5 63.6,1.4 62.3,1.4 62.1,1.2 39.4,1.2 38.6,2 37.6,3
  pour Route3: 37.7,8.7 37.5,8.9 37.5,11.3 38.4,12.2 39.7,12.2 41.4,13.9 41.4,15.7 54.5,15.7 54.5,6.6 55.5,5.6 59.6,5.6 63.7,1.5 62.4,1.5 62.2,1.3 39.5,1.3 37.7,3.1
  pour Bottom (isolate 0.1, no thermals): 37.6,8.6 37.4,8.8 37.4,11.2 38.3,12.1 39.6,12.1 41.3,13.8 41.3,15.6 54.4,15.6 54.4,6.5 55.4,5.5 59.5,5.5 63.6,1.4 62.3,1.4 62.1,1.2 39.4,1.2 37.6,3
LIFE3
  Top 0.254: R71.2 65.29,80.81 64.82,80.81 64.31,81.32 64.31,82.33 63.55,83.1 U6.P$9
  Bottom 0.254: R72.P$2 77.38,43.59 77.52,43.73 | 61.64,66.05 61.49,66.05 61.42,65.98
  Bottom 0.406: 77.52,43.73 76.25,43.73 67.11,52.87 67.11,60.29 61.42,65.98 LIFEPO3.PLUS | R67.1 79.69,45.97 R72.P$2
  pour Top (no thermals): 67.36,81.57 65.84,80.05 65.24,74 62.19,70.95 56.18,70.65 55.93,70.4 56.13,64.56 62.7,64.79 67.85,62.29 76.26,65.2 76.76,81.06 76.25,81.57
LIFE4  (via drill 0.61)
  Top 0.254: 78.87,36.28 79.43,36.84 U$5.P$1 | 78.87,36.28 78.63,36.04 78.63,32.71 R65.2 78.47,32.55 78.47,32.23 72.76,26.52 72.76,11.91 71.85,9.55 | 78.87,36.28 v78,37.15
  Top 5.08: LIFEPO4.PLUS 71.85,9.55 LIFEPO3.MINUS
  Bottom 0.254: v78,37.15 79.58,38.74 R73.P$1
  pour Top: 81.6,2 81.6,9.4 71.5,19.5 56.7,19.5 55.2,18 55.2,7.2 55.7,6.7 60.5,6.7 66,1.2 80.4,1.2 81.2,2
  pour Route3: 81.5,2 81.5,9.4 71.4,19.5 56.6,19.5 55.1,18 55.1,7.2 55.6,6.7 60.4,6.7 65.9,1.2 80.3,1.2 81.1,2
  pour Bottom: 81.6,2 81.6,9.4 71.5,19.5 56.7,19.5 55.2,18 55.2,7.2 55.7,6.7 60.5,6.7 66,1.2 80.4,1.2 81.2,2
LIFE_B2
  Bottom 0.254: 77.28,83.98 81.33,82.24 81.33,79.86 C26.1
  Bottom 0.406: 77.28,83.98 77.36,83.98 V27.P$1
  pour Top (no thermals): 79.55,77 84.63,77 85.65,78.02 85.65,85.64 87.44,88.34 82.27,92.34 76.39,87.97 74.09,84.85 75.01,82.03 77.77,81.83 79.3,80.3 79.3,77.25
LIFEB1SNS
  Top 0.508: 58.47,54.65 58.47,53.58 R41.P$2
  Top 5.08: 59,56.82 V14.P$1 58.54,54.72 58.47,54.65
  Top 7: LIFEPO2.MINUS 59,56.82
LION1
  Top 0.254: U3.P$9 10.69,60.97 11.16,60.97 11.32,60.81 11.32,58.9 11.64,58.58 13.23,58.58 14.34,59.7 R21.2 14.5,59.85 14.73,60.09 | 14.73,60.09 14.81,60.17 14.81,60.97 C8.1 | LI-ION1.PLUS 14.66,67.79 14.66,60.17 14.73,60.09
  Top 0.508: 20.88,74.71 20.91,74.75 U$1.P$1
  Top 1.27: LI-ION1.PLUS 17.3,71.1 R33.2 19.3,73.8 V45.P$1 20.31,74.71 20.88,74.71
  Bottom 0.254: C13.2 21.32,73.83 19.42,73.83 V45.P$1
LION2  (via drill 0.61)
  Top 0.254: LI-ION2.PLUS 34.18,67.95 35.29,66.84 35.29,65.57 v30.85,61.12 | v15.77,46.04 14.66,46.04 C9.1 14.5,46.04 13.54,45.09 13.54,42.71 R24.2 11.79,42.7 11.56,42.94 9.56,42.94 U4.P$9
  Top 0.508: 30.28,70.9 30.45,71.08 U$2.P$1
  Top 1.27: LI-ION2.PLUS 32.78,68.4 30.28,70.9
  Bottom 0.254: C14.2 30.53,71.76 33.86,68.43 LI-ION2.PLUS | v15.77,46.04 17.99,46.04 30.85,58.9 v30.85,61.12
  Bottom 0.406: R35.2 35.4,66.8 LI-ION2.PLUS
N$1  (via drill 0.61)
  Top 0.254: v11,77.48 10.69,77.79 9.1,77.79 8.15,78.75 7.04,78.75 U1.P$5
  Bottom 0.254: v11,77.48 10.37,77.48 9.73,76.84 9.42,76.84 M1.P$4
N$2  (via drill 0.61)
  Top 0.254: 7.67,80.33 7.51,80.33 7.04,79.86 U1.P$6 | 7.67,80.33 8.78,80.33 C2.1 | v7.83,76.84 7.99,77 9.57,77 R4.1 | v7.67,80.97 7.67,80.33
  Bottom 0.254: v7.83,76.84 8.94,77.95 9.26,77.95 M1.P$3 9.42,78.11 9.42,79.22 M1.P$2 | M1.P$1 9.42,80.49 9.42,79.38 M1.P$2 | v7.67,80.97 9.26,79.38 M1.P$2
N$3  (via drill 0.61)
  Top 0.254: R1.2 19.86,85.36 v20.37,85.64
  Bottom 0.254: v20.37,85.64 19.22,85.25 D7.A
N$4  (via drill 0.61)
  Top 0.254: v18.59,81.06 19.36,81.83 R3.1
  Bottom 0.254: D7.C 18.59,82.51 v18.59,81.06
N$5  (via drill 0.61)
  Top 0.254: C1.1 2.11,77.63 2.11,79.06 R2.2 2.27,79.22 2.75,79.7 4.34,79.7 U1.P$1 4.5,79.86 v5.45,80.81
  Bottom 0.254: M1.P$5 3.54,76.84 3.54,77.95 M1.P$6 3.54,78.11 3.54,78.91 | 3.54,78.91 3.54,79.22 M1.P$7 3.54,79.38 3.54,80.49 M1.P$8 | 3.54,78.91 v5.45,80.81
N$6
  Top 0.254: 0,82.1 2.5,82.1 2.5,90.4 84.2,90.4 84.2,81.8 86.7,81.8 86.7,13.1 83.2,13.1 83.2,0.2 10.1,0.2 10.1,15.9 0,15.9 0,82.1
N$7  (via drill 0.61)
  Top 0.254: v42.66,82.14 42.12,83.19 U5.P$13
  Bottom 0.254: v42.66,82.14 42.91,81.29 43.39,80.81 R51.1
N$8  (via drill 0.61)
  Top 0.254: U3.P$4 7.99,60.33 6.72,60.33 6.4,60.01 C4.2 6.4,59.85 5.45,58.9 v5.45,58.74
  Bottom 0.254: v5.45,58.74 5.45,57.79 4.5,56.84 L1.P$1
N$9
  Top 0.254: U3.P$2 7.99,61.44 6.56,61.44 6.4,61.6 C4.1
N$10
  Top 0.254: U4.P$2 5.65,43.45 C5.1
N$11  (via drill 0.61)
  Top 0.254: U4.P$4 6.88,42.39 5.92,42.39 5.45,41.92 C5.2 5.29,41.92 v4.02,41.92
  Bottom 0.254: v4.02,41.92 4.02,39.38 3.54,38.9 L2.P$1
N$12  (via drill 0.61)
  Top 0.254: v6.56,45.88 6.88,45.57 6.88,43.98 U4.P$1
  Bottom 0.254: v6.56,45.88 7.51,44.93 C7.1
N$13  (via drill 0.61)
  Top 0.254: v6.4,62.87 6.72,62.87 7.67,61.92 7.99,61.92 U3.P$1
  Bottom 0.254: v6.4,62.87 8.46,62.87 C6.1
N$14
  Top 0.254: U4.P$11 11.24,43.45 R23.1
N$15
  Top 0.254: U4.P$10 9.57,42.39 10.53,42.39 11.16,41.76 R23.2 11.32,41.6 11.96,40.96 13.39,40.96 R24.1
N$16
  Top 0.254: R22.1 12.39,59.58 11.99,59.98 11.99,60.95 11.48,61.45 U3.P$11
N$17
  Top 0.254: U3.P$10 10.69,60.33 10.85,60.17 10.85,58.58 11.8,57.63 12.27,57.63 R22.2 12.43,57.63 12.75,57.63 13.07,57.95 14.34,57.95 R21.1
N$18  (via drill 0.61)
  Top 0.254: v10.05,58.27 10.05,59.85 U3.P$8
  Bottom 0.254: v10.05,58.27 8.46,56.68 L1.P$2
N$19
  Top 0.254: U3.P$13 10.05,62.55 11.96,62.55 12.27,62.87 R25.2
N$20
  Top 0.254: U4.P$13 9.1,44.61 9.1,45.41 9.42,45.73 R26.2
N$21
  Top 0.254: U4.P$6 7.99,41.76 7.99,40.65 7.35,40.01 R30.1 7.35,39.85 7.35,37.95 R29.2
N$22
  Top 0.254: U3.P$6 9.1,59.85 9.1,58.74 8.3,57.95 R27.1 8.3,55.89 R28.2
N$23  (via drill 0.61)
  Top 0.254: v9.1,40.8 9.1,41.76 U4.P$8
  Bottom 0.254: v9.1,40.8 9.1,40.49 7.51,38.9 L2.P$2
N$24  (via drill 0.61)
  Top 0.254: v40.05,34.77 40.05,36.36 R54.P$1
  Bottom 0.254: U$3.P$7 37.67,34.77 38.78,34.77 U$3.P$8 38.94,34.77 v40.05,34.77
N$25
  Bottom 0.254: U$3.P$6 36.24,34.77 35.13,34.77 U$3.P$5 34.98,34.61 34.98,31.6 34.18,30.8 34.18,26.68 34.34,26.52 R55.P$2
N$26
  Top 0.254: U5.P$11 41.01,82.72 41.01,80.97 41.17,80.81 R52.1
N$27
  Top 0.254: 37.99,84.3 39.42,84.3 U5.P$6 | 37.99,84.3 37.52,84.78 R45.1 | 37.99,84.3 37.52,83.83 R46.2
N$28
  Top 0.254: U5.P$10 40.05,82.72 40.05,81.29 39.58,80.81 R52.2 39.58,80.65 39.58,78.91 R53.1
N$29
  Top 0.254: U5.P$1 41.64,85.41 42.44,86.21 42.44,86.68 C15.2
N$30  (via drill 0.61)
  Top 0.254: v34.78,85.73 38.15,85.73 38.47,85.41 40.05,85.41 U5.P$4
  Bottom 0.254: v34.78,85.73 36.72,85.73 36.88,85.57 L3.P$2 37.04,85.57 38.15,86.68 39.42,86.68 C16.1
N$31  (via drill 0.61)
  Top 0.254: U5.P$2 41.05,86.12 40.94,86.22 40.94,87.16 39.93,88.18 v39.42,88.18
  Bottom 0.254: v39.42,88.18 39.93,88.18 C16.2
N$32  (via drill 0.61)
  Top 0.254: v38.78,82.4 38.78,82.56 39.42,83.19 U5.P$8
  Bottom 0.254: v38.78,82.4 37.83,82.4 37.04,81.6 L3.P$1
N$33
  Top 0.254: 60.38,85.38 60.38,85.89 R63.1 | 60.38,85.38 60.38,84.78 R64.2 | U6.P$6 60.4,85.36 60.38,85.38
N$35
  Top 0.254: U6.P$13 65.24,84.35 65.41,83.08 R69.1
N$36
  Top 0.254: 64.03,83.67 U6.P$11 64.06,83.35 65.14,82.27 65.14,81.92 R70.1
N$37
  Top 0.254: U6.P$10 63.07,83.67 63.07,82.24 63.39,81.92 R70.2 63.48,80.82 R71.1
N$38
  Top 0.254: U6.P$1 64.66,86.52 65.93,86.52 66.25,86.84 C19.2
N$39  (via drill 0.61)
  Top 0.254: v58.79,86.68 61.17,86.68 61.33,86.52 63.07,86.52 U6.P$4
  Bottom 0.254: v58.79,86.68 60.38,86.68 L4.P$2 60.53,86.84 61.49,87.8 62.44,87.8 C20.1
N$40  (via drill 0.61)
  Top 0.254: U6.P$2 64.05,88.18 v63.3,88.94
  Bottom 0.254: v63.3,88.94 63.3,88.8 C20.2
N$41  (via drill 0.61)
  Top 0.254: v62.12,83.51 62.44,83.83 62.44,84.3 U6.P$8
  Bottom 0.254: v62.12,83.51 61.17,83.51 60.53,82.87 L4.P$1
N$42  (via drill 0.61)
  Top 0.254: U$5.P$7 U$5.P$8 | v80.7,41.12 U$5.P$7 | U$5.P$7
  Bottom 0.254: v80.7,41.12 80.7,43.5 R72.P$1
N$43  (via drill 0.61)
  Top 0.254: U$5.P$5 U$5.P$6 | v83.23,41.12 U$5.P$5 | U$5.P$5
  Bottom 0.254: v83.23,41.12 83.23,38.9 R73.P$2
N$68  (via drill 0.61)
  Top 0.254: v53.55,74.94 54.82,74.94 55.61,74.14 56.56,74.14 SW1.P$2
  Bottom 0.254: 53.55,73.83 55.3,73.83 R77.2 | R78.2 51.33,73.83 53.39,73.83 C25.2 53.55,73.83 | v53.55,74.94 53.55,73.83
N$451  (via drill 0.61)
  Top 0.254: v82.44,76.52 82.44,76.05 81.81,75.41 SW2.P$3
  Bottom 0.254: 81.33,76.52 81.33,77.79 R76.2 | 81.33,76.52 81.33,75.89 R82.2 | v82.44,76.52 81.33,76.52
N$686  (via drill 0.61)
  Top 0.254: v57.52,76.52 56.72,75.73 56.72,75.41 SW1.P$3
  Bottom 0.254: 56.25,76.52 56.25,77.79 R58.2 | 56.25,76.52 56.25,76.05 R79.2 56.25,76.52 | v57.52,76.52 56.25,76.52
N$1356  (via drill 0.61)
  Top 0.254: v83.71,73.83 81.97,73.83 81.81,73.98 SW2.P$2
  Bottom 0.254: R81.2 76.41,73.83 78.31,73.83 C28.2 78.47,73.83 80.38,73.83 R80.2 80.54,73.83 v83.71,73.83
PANELREF  (via drill 0.61)
  Top 0.254: v29.74,67.32 29.74,60.97 34.5,56.2 35.13,56.2 U$4.P$6 | v30.21,87.8 28.94,87.8 R13.1
  Bottom 0.254: v29.74,67.32 29.74,72.55 31.32,74.14 31.32,76.52 29.9,77.95 29.9,86.37 29.34,86.92 | 29.34,86.92 28.47,87.8 R14.2 | 29.34,86.92 v30.21,87.8
SCL
  Top 0.254: 38.47,51.6 37.67,52.39 U$4.P$1 | 38.47,51.6 39.58,51.6 U$6.P$22 | 38.47,51.6 38.47,42.87 V52.P$1
  Bottom 0.254: R85.1 36.88,38.25 36.88,41.44 38.24,42.8 V52.P$1
SDA  (via drill 0.61)
  Top 0.254: U$4.P$2 37.67,55.41 38.15,55.41 38.47,55.09 38.47,52.39 38.63,52.23 39.58,52.23 U$6.P$23 39.74,52.08 40.69,52.08 41.01,51.76 v42.75,51.76 | R86.1 38.4,39.27 V53.P$1
  Bottom 0.254: v42.75,51.76 42.75,44.14 38.47,39.85 V53.P$1
SP_C  (via drill 0.61)
  Top 0.254: R1.1 17.44,84.8 D1.C 15.45,82.87 15.4,82.9 | 3.89,81.22 3.94,82.87 D5.C | 9.26,82.9 9.26,82.87 D3.C | D2.C 12.43,83.03 12.4,82.9
  Top 0.406: R2.1 3.89,81.22 3.94,82.77 | 3.94,82.77 4.07,82.9 9.26,82.9 12.4,82.9 | 12.4,82.9 15.4,82.9 | D4.C 6.21,82.77 3.94,82.77 | R5.1 12.4,81.83 | 12.4,81.83 12.4,82.9 | v14.27,81.57 12.4,81.83
  Bottom 0.254: R6.2 R7.2
  Bottom 0.406: 3.4,82.95 R10.2 R9.2 R8.2 | R8.2 R7.2 | R7.2 12.69,82.9 v14.27,81.57 12.64,82.95 12.4,82.95 | R7.2 12.4,82.95 | R8.2 12.35,82.9 12.4,82.95
SP_C_O
  Top 0.254: R4.2 9.73,78.75 12.27,78.75 R5.2 12.43,78.75 15.29,78.75 16.24,79.7 V7.P$1 16.4,79.86 17.51,80.97 17.51,83.03 R3.2
  Bottom 0.254: R12.1 11.48,80.49 13.39,80.49 R11.1 13.54,80.33 15.77,80.33 16.24,79.86 V7.P$1
SP_OUT  (via drill 0.51, 1.02)
  Top 0.254: U4.P$3 2.1,42.95 1.83,43.22 | U3.P$3 4.45,60.95 R15.1 | U5.P$3 40.55,85.75 C17.2 | U6.P$3 63.55,86.75 C21.2
  Top 0.406: 1.83,43.22 2.35,42.7 C10.1 4.07,40 R30.2 | R16.1 3.06,45.8 1.83,47.03 | R27.2 4.5,57.8 C3.1 2.84,57.7 1.83,58.71 | R15.1 2.43,60.9 1.83,61.51 | 14.53,77.76 14.27,77.76 12.75,76.24 12.5,76.24 v11.99,76.75 | v35.86,87.92 37.09,86.7 R45.2 39.4,86.7 C17.2 | R63.2 62.4,87.7 C21.2
  Top 1.016: 1.83,43.22 1.83,47.03 1.83,58.71 1.83,61.51 1.83,69.63 5.64,73.44 6.65,73.44 8.43,75.22 11.99,75.22 14.53,77.76 18.59,77.76 22,81.17 D6.C 22.6,83.31 V8.P$1 26.11,83.35 R13.2 31.01,86.12 32.82,87.92 v35.86,87.92 | R63.2 60.18,87.92 v56.18,87.92
  Route3 1.016: v56.18,87.92 53.9,85.89 37.9,85.89 v35.86,87.92
  Bottom 0.406: v11.99,76.75 11.99,77.76 | 11.99,77.76 11.99,78.06 R12.2 | R11.2 12.87,78.65 11.99,77.76
SPF_ST  (via drill 0.61)
  Top 0.254: 5.84,77.08 6.56,77.79 6.88,77.79 U1.P$4 | 5.84,77.08 4.65,75.89 R83.1 | v26.56,55.89 32.75,49.7 33.86,49.7 U$6.P$6 | v5.77,77.16 5.84,77.08
  Bottom 0.254: v26.56,55.89 26.56,60.17 15.45,71.28 9.73,71.28 5.77,75.25 v5.77,77.16
UMB_CHG
  Top 1.27: V39.P$1 V1.P$1 22,87.4 D6.A
X_N
  Top 0.254: D2.A 13.2,85.57 13.2,87.8 V3.P$1
  Bottom 0.254: R7.1 V3.P$1
X_P
  Top 0.254: D1.A 16.25,87.55 V2.P$1 V49.P$1
  Bottom 0.254: R6.1 V2.P$1
Y_N
  Top 0.406: D5.A V6.P$1
  Bottom 0.406: R10.1 V6.P$1
Z_N
  Top 0.254: D4.A V5.P$1
  Bottom 0.254: R9.1 V5.P$1
Z_P
  Top 0.254: D3.A V4.P$1
  Bottom 0.254: R8.1 V4.P$1

## Text on the board
tNames: BSE: EquiSat / Battery Board V1 / November 2016 / Ryan Izant
bNames: BSE: EquiSat / Battery Board V1 / November 2016 / Ryan Izant
bValues: Y_N | Z_N | Z_P | X_N | X_P
tDocu: +Z | +X